# EAGLE design lipol_source (EAGLE 7.2.0)
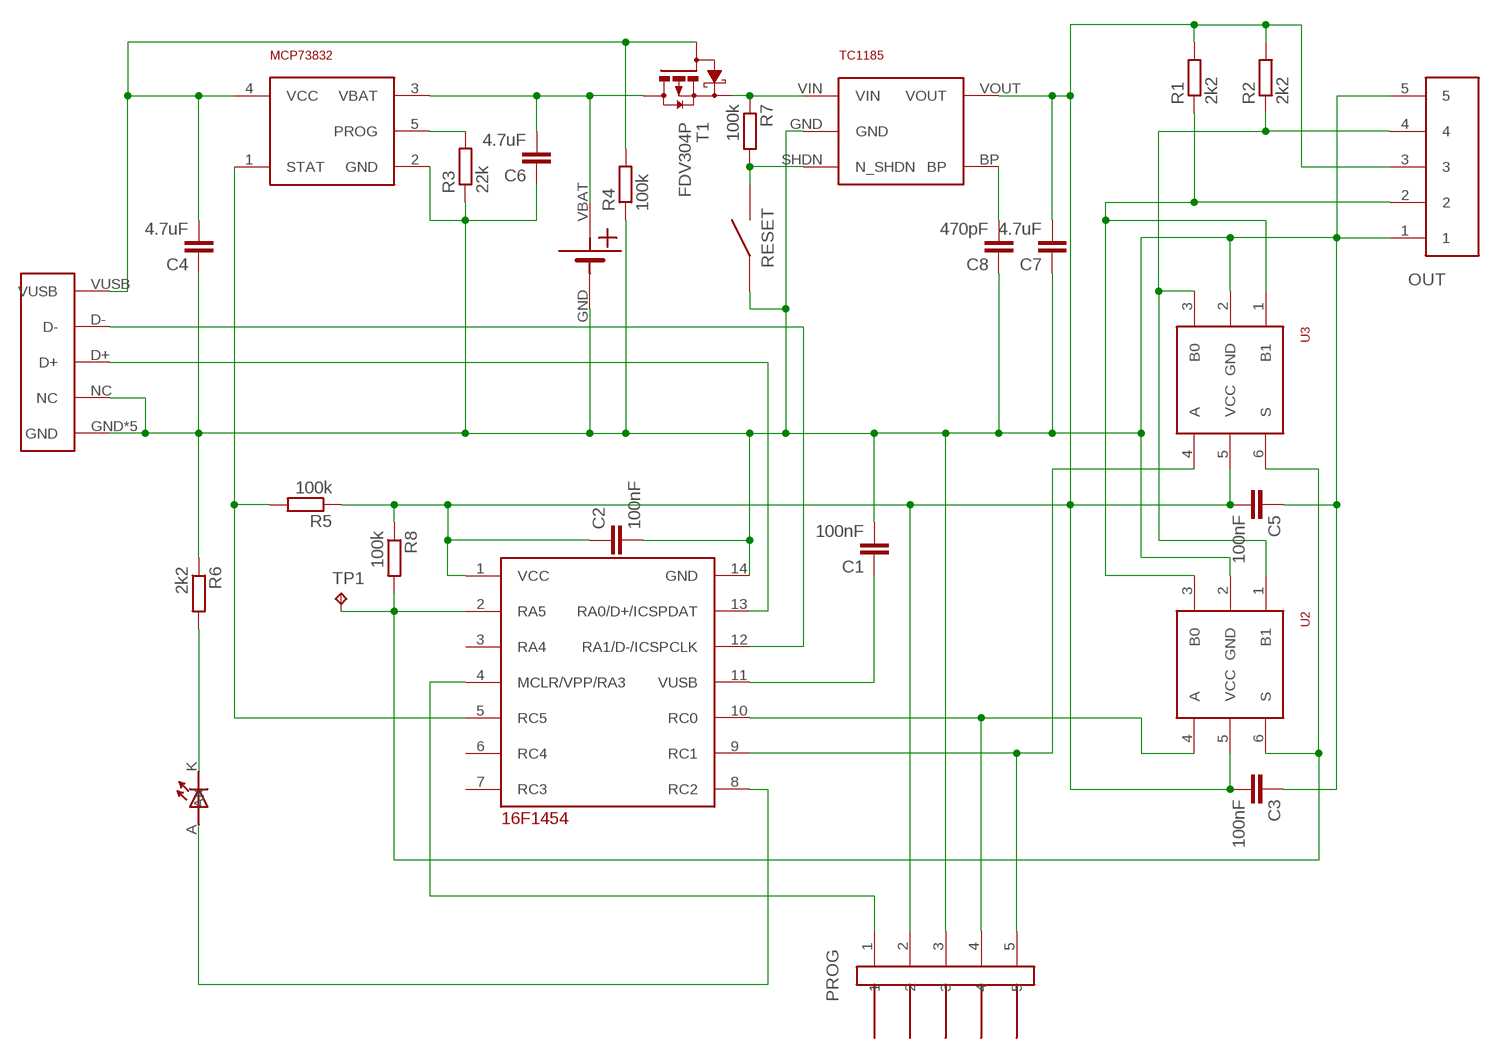
[diagram p0: schematic, sheet 1]

## Parts
C1  100nF  C-EUC0603K  [C0603K]
C2  100nF  C-EUC0603K  [C0603K]
C3  100nF  C-EUC0603K  [C0603K]
C4  4.7uF  C-EUC0603K  [C0603K]
C5  100nF  C-EUC0603K  [C0603K]
C6  4.7uF  C-EUC0603K  [C0603K]
C7  4.7uF  C-EUC0603K  [C0603K]
C8  470pF  C-EUC0603K  [C0603K]
D1  LED1.8  [LED1.8]
MCP73832  MCP73831  [SOT23-5]
OUT  JUMPER5F-90  [JUMPER5F-90]
PROG  JUMPER5M  [JUMPER5M]
R1  2k2  R-EU_R0603  [R0603]
R2  2k2  R-EU_R0603  [R0603]
R3  22k  R-EU_R0603  [R0603]
R4  100k  R-EU_R0603  [R0603]
R5  100k  R-EU_R0603  [R0603]
R6  2k2  R-EU_R0603  [R0603]
R7  100k  R-EU_R0603  [R0603]
R8  100k  R-EU_R0603  [R0603]
RESET  BYTTON-B3U  [BUTTON-B3U]
T1  FDV304P  P-MOSFET-FDV304P  [SOT23]
TC1185  STABILISER_APE8865  [SOT32-5]
TP1  TPB1,27  [B1,27]
U1  16F1454  [TSSOP14]
U2  NC7SB3157P6X  [SC70-6L]
U3  NC7SB3157P6X  [SC70-6L]
U$3  LIPOL_21X17  [LIPOL_21X17]
USB  USBMICRO  [MICROUSB-MOLEX]

## Nets
GND: C1.2 C2.2 C3.1 C4.1 C5.1 C6.1 C7.1 C8.1 MCP73832.2(GND) OUT.1 OUT.5 PROG.3 R3.1 R4.1 R6.1 RESET.P$1 TC1185.GND U1.14(GND) U2.2(GND) U3.2(GND) U$3.GND USB.GND USB.NC USB.P$1(GND) USB.P$2(GND) USB.P$3(GND) USB.P$6(GND)
N$1: R8.2 TP1.TP U1.2(RA5) U2.6(S) U3.6(S)
N$2: U1.12(RA1/D-/ICSPCLK) USB.D-
N$3: C1.1 U1.11(VUSB)
N$4: PROG.4 U1.10(RC0) U2.4(A)
N$5: U1.13(RA0/D+/ICSPDAT) USB.D+
N$6: OUT.2 R1.1 U2.3(B0) U3.1(B1)
N$7: PROG.5 U1.9(RC1) U3.4(A)
N$8: C6.2 MCP73832.3(VBAT) T1.D U$3.VBAT
N$9: C4.2 MCP73832.4(VCC) R4.2 T1.G USB.VUSB
N$10: OUT.4 R2.1 U2.1(B1) U3.3(B0)
N$11: MCP73832.5(PROG) R3.2
N$12: R7.1 T1.S TC1185.VIN
N$13: MCP73832.1(STAT) R5.2 U1.5(RC5)
N$14: PROG.1 U1.4(MCLR/VPP/RA3)
N$15: D1.K R6.2
N$16: D1.A U1.8(RC2)
N$17: C8.2 TC1185.BP
N$20: R7.2 RESET.P$2 TC1185.SHDN(N_SHDN)
VCC: C2.1 C3.2 C5.2 C7.2 OUT.3 PROG.2 R1.2 R2.2 R5.1 R8.1 TC1185.VOUT U1.1(VCC) U2.5(VCC) U3.5(VCC)
Unconnected: U1.3(RA4) U1.6(RC4) U1.7(RC3)

## Library data of the parts
C1-C8 = resistor:C-EU: CAPACITOR, European symbol
D1 = !stavebnice03:LED1.8
MCP73832 = !stavebnice03:MCP73831
OUT = !stavebnice03:JUMPER5F-90
PROG = !stavebnice03:JUMPER5M
R1-R8 = resistor:R-EU_: RESISTOR, European symbol
RESET = !stavebnice03:BYTTON-B3U
T1 = !stavebnice03:P-MOSFET-FDV304P
TC1185 = !stavebnice03:STABILISER_APE8865
TP1 = testpad:TP: Test pad
U1 = !stavebnice03:16F1454
U2 U3 = !stavebnice03:NC7SB3157P6X
U$3 = !stavebnice03:LIPOL_21X17
USB = !stavebnice03:USBMICRO

## Net classes
0 default: clearance 0.205 mm

## Board
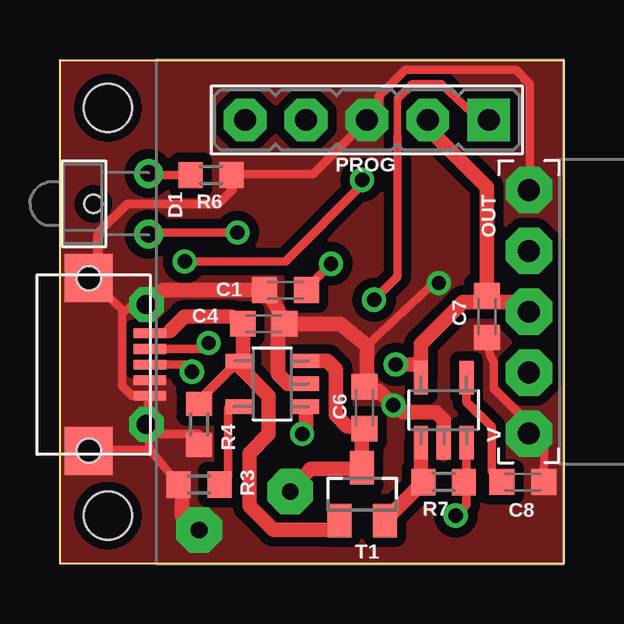
[diagram p1: board, top side]
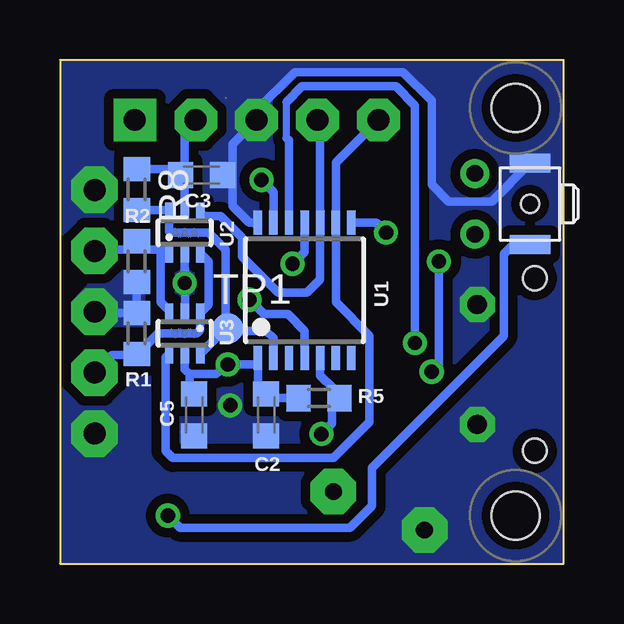
[diagram p2: board, bottom side, seen from below]

Size 21 x 21 mm. Coordinates in mm from the lower left corner, seen from the top.
Outline: 0,0 0,21 21,21 21,0 0,0
Copper layers (1*16): Top 0.035mm / dielectric 1.5mm / Bottom 0.035mm
Design rules "default *": minimum track width 10mil, minimum drill 0.015240625mm, track to track 8mil, track to pad 8mil, pad to pad 8mil, via to via 8mil, smd to smd 8mil, copper to edge 0mil, drill to drill 1mil, minimum pad ring 10mil, minimum via ring 8mil, stop-mask expansion 7mil, vias tented up to drill 0.7mm, thermal gap 10mil
Holes 2 mm at 2,19 2,2

### Footprints (pad centres in the part's own frame; a part is rotated, then mirrored left to right if it is on the bottom)
C0603K = smd 1.05 x 1.08: 1 -0.875,0; 2 0.875,0
LED1.8 = drill 0.7: A -1.27,-0.4; K 1.27,-0.4
SOT23-5 = smd 0.6 x 1.1: 1 -0.95,-1.45; 2 0,-1.45; 3 0.95,-1.45; 4 0.95,1.35; 5 -0.95,1.35
JUMPER5F-90 = drill 0.914 pad 1.93 octagon: 1 5.08,-2.54; 2 2.54,-2.54; 3 0,-2.54; 4 -2.54,-2.54; 5 -5.08,-2.54
JUMPER5M = drill 0.914 pad 1.778 square: 1 -5.08,0 | drill 0.914 pad 1.778 octagon: 2 -2.54,0; 3 0,0; 4 2.54,0; 5 5.08,0
R0603 = smd 1 x 1.1: 1 -0.85,0; 2 0.85,0
BUTTON-B3U = smd 0.8 x 1.7: P$1 -1.7,0; P$2 1.7,0 | hole 0.75: 0,0
SOT23 = smd 1 x 1.4: D 0,1.1; G -0.95,-1.1; S 0.95,-1.1
SOT32-5 = smd 0.6 x 1.4: BP 0.95,1.35; GND 0,-1.35; SHDN 0.95,-1.35; VIN -0.95,-1.35; VOUT -0.95,1.35
B1,27 = smd 1.27 x 1.27: TP 0,0
TSSOP14 = smd 0.35 x 1: 1 -1.95,-2.825; 2 -1.3,-2.825; 3 -0.65,-2.825; 4 0,-2.825; 5 0.65,-2.825; 6 1.3,-2.825; 7 1.95,-2.825; 8 1.95,2.825; 9 1.3,2.825; 10 0.65,2.825; 11 0,2.825; 12 -0.65,2.825; 13 -1.3,2.825; 14 -1.95,2.825
SC70-6L = smd 0.35 x 0.8: 1 -0.65,-0.85; 2 0,-0.85; 3 0.65,-0.85; 4 0.65,0.85; 5 0,0.85; 6 -0.65,0.85
LIPOL_21X17 = drill 0.7 pad 1.9 octagon: GND 6.3,9.7; VBAT 2.5,8.1
MICROUSB-MOLEX = smd 0.4 x 1.35: D+ 0,2.35; D- -0.65,2.35; GND 1.3,2.35; NC 0.65,2.35; VUSB -1.3,2.35 | smd 2 x 2: P$1 3.6,-0.2; P$2 -3.6,-0.2 | drill 0.8 pad 1.45 octagon: P$3 -2.5,2.2; P$6 2.5,2.2 | hole 1: 3.6,-0.2; -3.6,-0.2

### Placement (x,y rotation side)
C1  9.4,11.4 180 top
C2  12.4,6.2 270 bottom
C3  15.1,16.2 180 bottom
C4  8.5,10 180 top
C5  15.4,6.2 90 bottom
C6  12.7,6.5 270 top
C7  17.8,10.3 90 top
C8  19.3,3.4 180 top
D1  3.3,15 90 top
MCP73832  8.8,7.5 90 top
OUT  22.1,10.5 270 top
PROG  12.8,18.5 180 top
R1  17.8,9.6 90 bottom
R2  17.8,12.6 270 bottom
R3  5.8,3.3 0 top
R4  5.8,5.8 90 top
R5  10.2,6.9 0 bottom
R6  6.3,16.2 180 top
R7  16,3.4 0 top
R8  17.8,15.6 270 bottom
RESET  1.4,15 270 bottom
T1  12.6,2.9 0 top
TC1185  16,6.4 0 top
TP1  14,9.8 0 bottom
U1  10.8,11.4 0 bottom
U2  15.8,13.8 0 bottom
U3  15.8,9.6 180 bottom
U$3  12.1,11.1 180 top
USB  1.4,8.3 270 top

### Tracks (layer width: path | path; a pad name or v marks a point on that pad's centre or on a via)
GND  (via drill 0.6)
  Top 0.356: 3.8,10.65 USB.P$3 3.6,10.7 2.9,10.7 2.6,10.4 | 19.64,5.4 OUT.1 | 5.03,3.52 R3.1 3.75,4.75 | 1.4,12.1 1.4,12.4 1.6,12.4 | 9.1,10.25 C4.1 | R4.1 5.8,5.4 4.1,5.4 USB.P$6 | v15.8,11.7 15.6,11.7 12.8,9.1 | USB.P$6 3.7,6.85 USB.GND | OUT.1 19.66,5.74 18.1,7.3 18.1,8.4 17.95,8.65 C7.1 | C8.1 20.2,4.78 OUT.1 | 3.75,4.75 USB.P$6 | 2.6,10.4 2.6,7.4 3,7 3.7,7 | 3.75,4.75 1.35,4.75 USB.P$1 | 2.6,10.4 2.6,10.6 USB.P$2 | 1.6,13.7 1.6,13.8 2.8,15 6.6,15 7.2,15.6 7.2,16.15 R6.1 7.2,16.25 10.55,16.25 PROG.3 13.3,18.9 13.3,19.5 14.4,20.6 19,20.6 19.6,20 19.6,15.6
  Top 0.406: 1.6,12.4 1.6,13.7
  Top 0.6: U$3.GND 5.1,2 5.1,3.52 5.03,3.52 | USB.P$3 4.3,11.4 C1.2 8.55,11.45 9.1,10.6 9.1,10.55 C4.1 11.7,10 12.8,9.1 12.8,7.47 | MCP73832.2 9.5,7.5 9.1,7.9 9.1,10.25 | TC1185.GND 16,6 15.7,6.3 14.3,6.3 v13.9,6.6 13.3,7.2 12.8,7.2 12.8,7.47 | 12.8,7.47 C6.1
  Bottom 0.356: C5.1 15.15,5.45 | U1.14 13.12,14.22 13.8,14.9 13.8,17.5 PROG.3 12.8,18.9 11.2,20.5 6.7,20.5 5.5,19.3 5.5,15.8 4.8,15.1 3,15.1 RESET.P$1 1.5,16.6
  Bottom 0.357: v15.8,11.7 15.79,10.81 U2.2 15.79,11.71 v15.8,11.7 | U3.2 15.79,10.79 v15.8,11.7 | C5.1 15.8,5.5
  pour Bottom (isolate 0.41, rank 2, no thermals): 0.1,0.1 0.1,20.9 20.9,20.9 20.9,0.1
  pour Top (isolate 0.4, rank 2, no thermals): 0.1,0.1 20.9,0.1 20.9,20.9 0.1,20.9
N$1
  Bottom 0.356: 16.44,13.84 16.45,13.85 U2.6 16.55,14.75 R8.2 | U3.6 14.2,9.7 14.1,9.7 14,9.7 | 14,9.7 12.4,9.7 12.1,9.4 U1.2 | TP1.TP 14,9.7
  Bottom 0.357: 16.44,13.84 16.4,13.8 14.8,13.8 14.1,13.1 14.1,9.7
N$2  (via drill 0.6)
  Top 0.356: USB.D- 5.95,8.95 v6.2,9.2
  Bottom 0.3: 11.55,17.75 11.55,19.25
  Bottom 0.356: U1.12 11.45,17.65 11.55,17.75 | 11.55,19.25 10.9,19.9 7,19.9 6.2,19.1 v6.2,9.2
N$3  (via drill 0.6)
  Top 0.357: C1.1 10.5,11.7 v11.3,12.5
  Bottom 0.357: U1.11 10.8,13 v11.3,12.5
N$4
  Bottom 0.356: 15.1,14.6 U2.4 15,14.5 14.3,14.5 13.4,13.6 13.4,12.8 11.9,11.3 10.7,11.3 10.15,11.85 U1.10 10.15,18.3 | 10.15,18.3 10.15,18.39 | PROG.4 10.15,18.3
N$5  (via drill 0.6)
  Top 0.356: USB.D+ 5.2,8.3 v5.5,8 | v5.2,12.6 9.4,12.6 12.6,15.8 v12.6,16
  Bottom 0.356: v5.5,8 5.2,8.3 v5.2,12.6 | U1.13 12.1,15.5 v12.6,16
N$6
  Bottom 0.356: U3.1 15.15,9.75 15.3,9.6 16.9,9.6 17.7,8.8 17.9,8.8 17.95,8.75 R1.1 18.1,8.7 18.82,8.7 OUT.2
  Bottom 0.357: U2.3 14.8,12.6 14.8,10.79 U3.1
N$7
  Bottom 0.356: U3.4 16.6,8.6 16.6,4.7 16.3,4.4 9.6,4.4 8.1,5.9 8.1,9.5 9.5,10.9 U1.9 9.5,16.72 PROG.5
N$8
  Top 0.6: MCP73832.3 11.15,8.45 11.5,8.1 11.5,6.2 11.97,5.72 C6.2 12.7,5.7 12.6,5.6 T1.D 12.35,4 12.35,3.95 10.44,3.95 U$3.VBAT
N$9
  Top 0.356: R4.2 5.9,6.8
  Top 0.4: 4.6,9.7 4.6,9.6 USB.VUSB
  Top 0.406: 5.9,6.8 5.9,6.9 MCP73832.4
  Top 0.6: 4.6,9.7 5.2,10.3 7.15,10.3 C4.2 7.62,8.62 MCP73832.4 | MCP73832.4 7.35,8.45 | T1.G 11.3,1.4 8.9,1.4 7.9,2.4 7.9,4.6 8.7,5.4 8.7,7 7.5,8.2 7.5,8.4 MCP73832.4
N$10
  Bottom 0.356: U3.3 16.45,10.55 16.8,10.9 16.8,13.1 | 16.45,12.85 U2.1 16.6,13.1 16.8,13.1 | 16.8,13.1 17.8,13.1 | 17.8,13.1 19.5,13.1 OUT.4 | R2.1 17.8,13.1
N$11
  Top 0.356: 6.85,3.6 R3.2 | 7,6.5 7.7,6.5 MCP73832.5
  Top 0.357: 7,6.5 7,3.6 6.85,3.6
N$12
  Top 0.6: T1.S R7.1 15.05,3.4 TC1185.VIN
N$13  (via drill 0.6)
  Top 0.356: 10.25,5.65 v10.1,5.4
  Top 0.6: 10.25,5.65 MCP73832.1
  Bottom 0.356: 9.4,6.9 R5.2 | v10.1,5.4 9.65,5.85 9.65,6.4 R5.2 | U1.5 10.15,7.85 9.6,7.3 9.6,7.15 R5.2
N$14  (via drill 0.6)  (1 unrouted)
  Top 0.305: 14.07,19.4 14.07,17.8
  Top 0.356: 14.7,20 15.9,20 17.48,18.52 PROG.1 | 14.07,17.8 14.07,11.97 v13.1,11
  Top 0.357: 14.1,19.4 14.7,20
  Bottom 0.356: v13.1,11 12.5,10.4 11.5,10.4 10.8,9.7 U1.4
N$15
  Top 0.356: 5.48,16.17 R6.2 3.77,16.2 D1.K
N$16  (via drill 0.6)
  Top 0.356: v7.4,13.8 3.77,13.8 D1.A
  Bottom 0.356: v7.39,13.8 v7.4,13.8 7.83,14.22 U1.8
N$17
  Top 0.356: TC1185.BP 16.95,6.75 18,5.7 18,3.85 C8.2
N$20  (via drill 0.6)
  Top 0.356: R7.2 16.95,3.2 TC1185.SHDN 16.95,2.45 v16.5,2
  Bottom 0.356: v16.5,2 16,1.5 8.9,1.5 8,2.4 8,4 2.5,9.5 2.5,12.9 1.9,13.5 RESET.P$2
VCC  (via drill 0.6)
  Top 0.356: C7.2 17.95,11.15 18.2,10.9
  Top 0.6: C7.2 17.8,15.7 15.4,18.1 15.4,18.5 PROG.2 | OUT.3 19.16,10.9 18.2,10.9 16.8,10.9 15.05,9.15 15.05,8.3 | TC1185.VOUT 15.05,8.3 | 15.05,8.3 v14,8.3
  Bottom 0.356: U1.1 12.75,8.3 | v14,8.3 12.75,8.3 | U2.5 15.8,15.85 C3.2 | R5.1 12.55,6.9 C2.1 12.75,7.08 12.75,8.3 | C3.2 15.7,15.9 | OUT.3 19.51,10.45 R1.2 R2.2 | U3.5 15.8,8.1 15.6,7.9 | 15.5,18.2 PROG.2 | R8.1 16.23,16.45 C3.2
  Bottom 0.357: 15.79,15.83 C3.2 | C5.2 15.6,7 15.6,7.9 14.5,7.9 v14,8.3 | 15.85,15.9 C3.2 | C3.2 15.8,15.9 15.8,18 15.5,18.2
  pour Bottom (isolate 0.4, no thermals): 17.5,12.2 19.3,12.2 20.4,11 20.4,10.2 20.3,9.9 17.5,9.9

### Text on the board
Top: II=I+I
Bottom: II=I+I
Reference: Lipol source